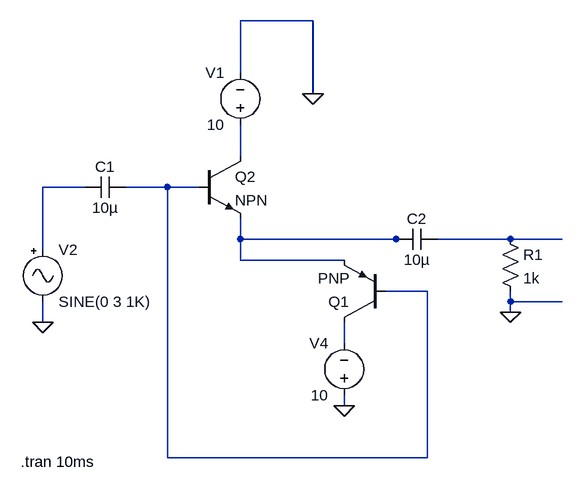
[diagram p0: schematic exp_8_electro.asc]
exp_8_electro.asc, the LTspice schematic file:
Version 4
SHEET 1 880 680
WIRE 480 -176 368 -176
WIRE 368 -96 368 -176
WIRE 480 -64 480 -176
WIRE 368 32 368 -16
WIRE 128 80 64 80
WIRE 256 80 192 80
WIRE 304 80 256 80
WIRE 368 160 368 128
WIRE 608 160 368 160
WIRE 624 160 608 160
WIRE 784 160 672 160
WIRE 864 160 784 160
WIRE 64 176 64 80
WIRE 368 192 368 160
WIRE 528 192 368 192
WIRE 656 240 592 240
WIRE 784 256 784 240
WIRE 864 256 784 256
WIRE 784 272 784 256
WIRE 64 288 64 256
WIRE 528 320 528 288
WIRE 528 416 528 400
WIRE 256 496 256 80
WIRE 656 496 656 240
WIRE 656 496 256 496
FLAG 480 -64 0
FLAG 64 288 0
FLAG 528 416 0
FLAG 784 272 0
SYMBOL cap 192 64 R90
WINDOW 0 0 32 VBottom 2
WINDOW 3 32 32 VTop 2
SYMATTR InstName C1
SYMATTR Value 10µ
SYMBOL voltage 528 416 R180
WINDOW 0 24 96 Left 2
WINDOW 3 24 16 Left 2
WINDOW 123 0 0 Left 0
WINDOW 39 0 0 Left 0
SYMATTR InstName V4
SYMATTR Value 10
SYMBOL cap 672 144 R90
WINDOW 0 0 32 VBottom 2
WINDOW 3 32 32 VTop 2
SYMATTR InstName C2
SYMATTR Value 10µ
SYMBOL res 768 144 R0
SYMATTR InstName R1
SYMATTR Value 1k
SYMBOL Misc\\signal 64 160 R0
WINDOW 123 0 0 Left 0
WINDOW 39 0 0 Left 0
SYMATTR InstName V2
SYMATTR Value SINE(0 3 1K)
SYMBOL voltage 368 0 R180
WINDOW 0 24 96 Left 2
WINDOW 3 24 16 Left 2
WINDOW 123 0 0 Left 0
WINDOW 39 0 0 Left 0
SYMATTR InstName V1
SYMATTR Value 10
SYMBOL pnp 592 288 R180
SYMATTR InstName Q1
SYMBOL npn 304 32 R0
SYMATTR InstName Q2
TEXT 30 502 Left 2 !.tran 10ms

The netlist it stands for:
* exp_8_electro.asc
C1 N003 N002 10µ
V4 0 N006 10
C2 N005 N004 10µ
R1 N005 0 1k
V2 N002 0 SINE(0 3 1K)
V1 N001 0 10
Q1 N006 N003 N004 0 PNP
Q2 N001 N003 N004 0 NPN
.model NPN NPN
.model PNP PNP
.lib standard.bjt
.tran 10ms
.backanno
.end